# Altium schematic sheet 原理图.SchDoc
size A4
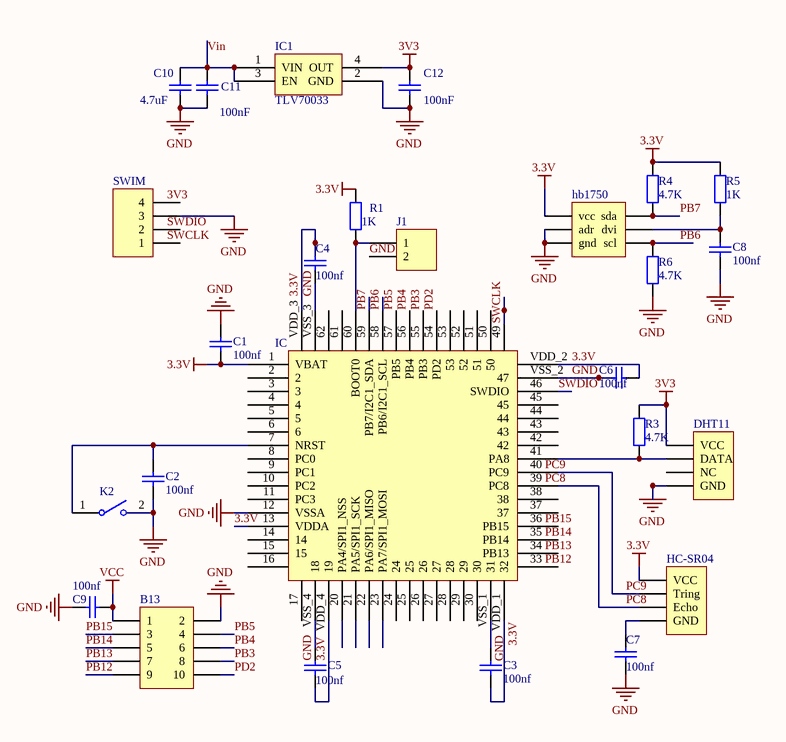
[diagram p0: 原理图.SchDoc]

## Parts
B13  Header 5X2  [HDR2X5]  (value not drawn)
C1  value 100nf  [0603C]  (hidden comment: Cap)
C2  value 100nf  [0603C]  (hidden comment: Cap)
C3  value 100nf  [0603C]  (hidden comment: Cap)
C4  value 100nf  [0603C]  (hidden comment: Cap)
C5  value 100nf  [0603C]  (hidden comment: Cap)
C6  value 100nf  [0603C]  (hidden comment: Cap)
C7  value 100nf  [0603C]  (hidden comment: Cap)
C8  value 100nf  [0603C]  (hidden comment: Cap)
C9  value 100nf  [0603C]  (hidden comment: Cap)
C10  value 4.7uF  [0603C]  (hidden comment: Cap)
C11  value 100nF  [0603C]  (hidden comment: Cap)
C12  value 100nF  [0603C]  (hidden comment: Cap)
DHT11  Header 4  [HDR1X4]  (value not drawn)
hb1750  (no value)  [HDR2X3]
HC-SR04  Header 4  [HDR1X4]  (value not drawn)
IC  (no value)
IC1  TLV70033  [PCBComponent_1]
J1  (no value)  [HDR1X2]
K2  SW-SPST  [SOP4]  (value not drawn)
R1  value 1K  [0603C]  (hidden comment: Res2)
R3  value 4.7K  [0603C]  (hidden comment: Res2)
R4  value 4.7K  [0603C]  (hidden comment: Res2)
R5  value 1K  [0603C]  (hidden comment: Res2)
R6  value 4.7K  [0603C]  (hidden comment: Res2)
SWIM  Header 4  [HDR1X4]  (value not drawn)

## Nets
3.3V: C1.2 C3.1 C4.2 C5.1 C6.2 hb1750.1(vcc) HC-SR04.1(VCC) IC.1(VBAT) IC.13(VDDA) IC.VDD_1(32) IC.VDD_2 IC.VDD_3 IC.VDD_4(19) R1.1 R4.1 R5.1
3V3: C12.2 DHT11.1(VCC) IC1.4(OUT) R3.1
GND: B13.2 C1.1 C2.2 C3.2 C4.1 C6.1 C7.1 C8.1 C9.1 C10.1 C11.1 C12.1 DHT11.4(GND) hb1750.3(adr) hb1750.5(gnd) IC.12(VSSA) IC.VSS_1(31) IC.VSS_2(47) IC.VSS_3 IC1.2(GND) J1.2 K2.2(NO) R6.2 SWIM.3
VCC: B13.1 C9.2
PB3: B13.8 IC.55(PB3)
PB4: B13.6 IC.56(PB4)
PB5: B13.4 IC.57(PB5)
PB6: hb1750.6(scl) IC.58(PB6/I2C1_SCL) R6.1
PB7: hb1750.2(sda) IC.59(PB7/I2C1_SDA) R4.2
PB12: B13.9
PB13: B13.7
PB14: B13.5
PB15: B13.3
PC8: HC-SR04.3(Echo) IC.39(PC8)
PC9: HC-SR04.2(Tring) IC.40(PC9)
PD2: B13.10 IC.54(PD2)
SWCLK: IC.49
SWDIO: IC.46(SWDIO)
Vin: C10.2 C11.2 IC1.1(VIN) IC1.3(EN)
NetC2_1: C2.1 IC.7(NRST) K2.1(COMMON)
NetC5_2: C5.2 IC.VSS_4(18)
NetC7_2: C7.2 HC-SR04.4(GND)
NetC8_2: C8.2 hb1750.4(dvi) R5.2
NetDHT11_2: DHT11.2(DATA) IC.41(PA8) R3.2
NetIC_60: IC.60(BOOT0) J1.1 R1.2

Not connected (* = marked no-connect by the designer): DHT11 3(NC); IC 2 3 4 5 6 8(PC0) 9(PC1) 10(PC2) 11(PC3) 14 15 16 17 20(PA4/SPI1_NSS) 21(PA5/SPI1_SCK) 22(PA6/SPI1_MISO) 23(PA7/SPI1_MOSI) 24 25 26 27 28 29 30 33 34(PB13) 35(PB14) 36(PB15) 37 38 42 43 44 45 50 51 52 53 61 62; SWIM 1 2 4

## Notes on the sheet
- Labels drawn without touching a wire or pin: 3V3, GND, PB12, PB13, PB14, PB15, PC8, PC9, SWCLK, SWDIO

## Library data of the parts
B13 = Header 5X2: Header, 5-Pin, Dual row; LatestRevisionDate: 17-Jul-2002; LatestRevisionNote: Re-released for DXP Platform.; Publisher: Altium Limited
C1-C12 = Cap: Capacitor; Published: 8-Jun-2000; LatestRevisionDate: 17-Jul-2002; LatestRevisionNote: Re-released for DXP Platform.; PackageReference: RAD-0.3; Publisher: Altium Limited; PackageDescription: Radial Cap, Thru-Hole; 2 Leads; 0.3 in Pin Spacing
DHT11 HC-SR04 SWIM = Header 4: Header, 4-Pin; LatestRevisionDate: 17-Jul-2002; LatestRevisionNote: Re-released for DXP Platform.; Publisher: Altium Limited
hb1750 = Header 3X2: Header, 3-Pin, Dual row; LatestRevisionDate: 17-Jul-2002; LatestRevisionNote: Re-released for DXP Platform.; Publisher: Altium Limited
IC IC1 = Component_1
J1 = Header 2: Header, 2-Pin; LatestRevisionDate: 17-Jul-2002; LatestRevisionNote: Re-released for DXP Platform.; Publisher: Altium Limited
K2 = SW-SPST: Single-Pole, Single-Throw Switch; Published: 24-Mar-1999; LatestRevisionDate: 17-Jul-2002; LatestRevisionNote: Re-released for DXP Platform.; PackageReference: SPST-2; Publisher: Altium Limited; PackageDescription: Switch; 2 Leads
R1 R3-R6 = Res2: Resistor; Published: 8-Jun-2000; LatestRevisionDate: 17-Jul-2002; LatestRevisionNote: Re-released for DXP Platform.; PackageReference: AXIAL-0.4; Publisher: Altium Limited; PackageDescription: Axial Device, Thru-Hole; 2 Leads; 0.4 in Pin Spacing